# Altium schematic sheet EPS_DCDC_RLCLs.SchDoc: DCDC / RLCLs
size A4; SheetNumber: 36; SheetTotal: 51
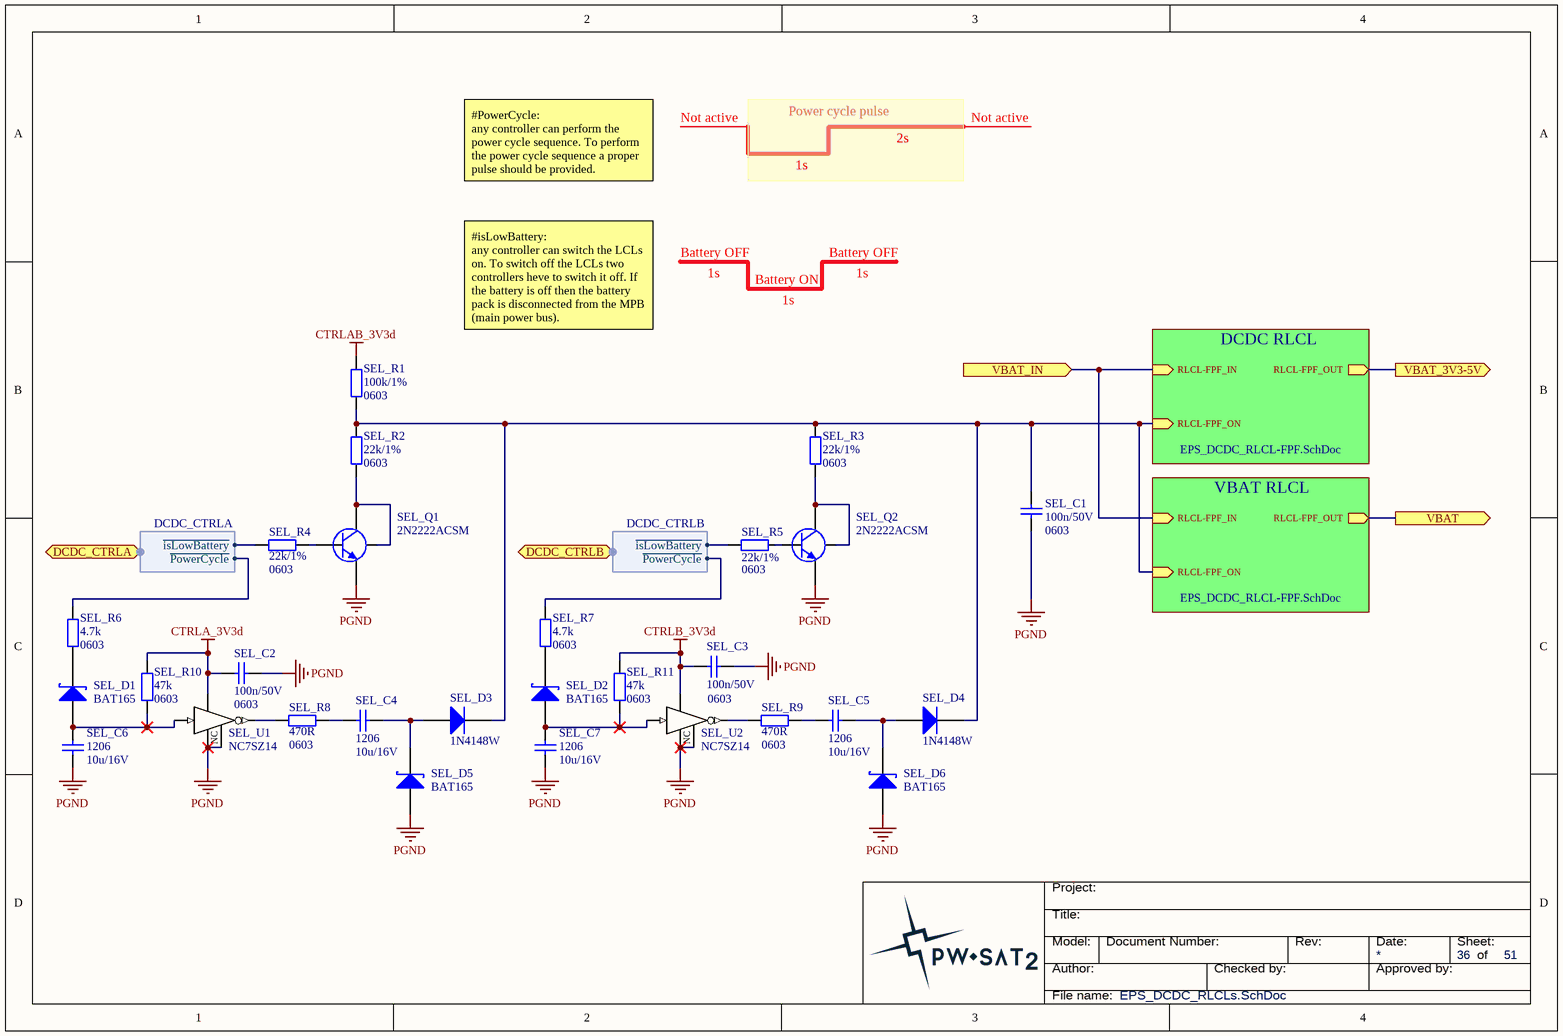
[diagram p0: EPS_DCDC_RLCLs.SchDoc]

## Parts
SEL_C1  value 100n/50V  Package: 0603  [SMD_Capacitor_0603]  (hidden comment: Cap)
SEL_C2  Package: 0603  [SMD_Capacitor_0603]  (hidden comment: 100n/50V)
SEL_C3  Package: 0603  [SMD_Capacitor_0603]  (hidden comment: 100n/50V)
SEL_C4  Packge: 1206  [SMD_Capacitor_1206]  (hidden comment: 10u/16V)
SEL_C5  Packge: 1206  [SMD_Capacitor_1206]  (hidden comment: 10u/16V)
SEL_C6  Packge: 1206  [SMD_Capacitor_1206]  (hidden comment: 10u/16V)
SEL_C7  Packge: 1206  [SMD_Capacitor_1206]  (hidden comment: 10u/16V)
SEL_D1  BAT165  [SOD323]
SEL_D2  BAT165  [SOD323]
SEL_D3  1N4148W  [SOD-123]
SEL_D4  1N4148W  [SOD-123]
SEL_D5  BAT165  [SOD323]
SEL_D6  BAT165  [SOD323]
SEL_Q1  2N2222ACSM  [LCC1-4_BEC]
SEL_Q2  2N2222ACSM  [LCC1-4_BEC]
SEL_R1  Package: 0603  [SMD_Resistor_0603]  (hidden comment: 100k/1%)
SEL_R2  Package: 0603  [SMD_Resistor_0603]  (hidden comment: 22k/1%)
SEL_R3  Package: 0603  [SMD_Resistor_0603]  (hidden comment: 22k/1%)
SEL_R4  Package: 0603  [SMD_Resistor_0603]  (hidden comment: 22k/1%)
SEL_R5  Package: 0603  [SMD_Resistor_0603]  (hidden comment: 22k/1%)
SEL_R6  Package: 0603  [SMD_Resistor_0603]  (hidden comment: 4.7k)
SEL_R7  Package: 0603  [SMD_Resistor_0603]  (hidden comment: 4.7k)
SEL_R8  Package: 0603  [SMD_Resistor_0603]  (hidden comment: 470R)
SEL_R9  Package: 0603  [SMD_Resistor_0603]  (hidden comment: 470R)
SEL_R10  Package: 0603  [SMD_Resistor_0603]  (hidden comment: 47k)
SEL_R11  Package: 0603  [SMD_Resistor_0603]  (hidden comment: 47k)
SEL_U1  NC7SZ14  [SOT23-5]
SEL_U2  NC7SZ14  [SOT23-5]

## Sub-sheets
DCDC RLCL = EPS_DCDC_RLCL-FPF.SchDoc: RLCL-FPF_IN (in), RLCL-FPF_OUT (out), RLCL-FPF_ON (in)
VBAT RLCL = EPS_DCDC_RLCL-FPF.SchDoc: RLCL-FPF_IN (in), RLCL-FPF_OUT (out), RLCL-FPF_ON (in)

## Ports
DCDC_CTRLA (harness DCDC_CTRLA), DCDC_CTRLB (harness DCDC_CTRLB), VBAT (out), VBAT_3V3-5V (out), VBAT_IN (in)

## Harnesses
DCDC_CTRLB: ~{PowerCycle}, ~{isLowBattery}
DCDC_CTRLA: ~{PowerCycle}, ~{isLowBattery}

## Nets
CTRLA_3V3d: SEL_C2.1 SEL_R10.2 SEL_U1.5(Vcc)
CTRLAB_3V3d: SEL_R1.2
CTRLB_3V3d: SEL_C3.1 SEL_R11.2 SEL_U2.5(Vcc)
PGND: SEL_C1.2 SEL_C2.2 SEL_C3.2 SEL_C6.1 SEL_C7.1 SEL_D5.A SEL_D6.A SEL_Q1.E SEL_Q2.E SEL_U1.1(NC) SEL_U1.3(GND) SEL_U2.1(NC) SEL_U2.3(GND)
VBAT: port VBAT, sheet VBAT RLCL/RLCL-FPF_OUT
VBAT_3V3-5V: port VBAT_3V3-5V, sheet DCDC RLCL/RLCL-FPF_OUT
VBAT_IN: port VBAT_IN, sheet DCDC RLCL/RLCL-FPF_IN, sheet VBAT RLCL/RLCL-FPF_IN
NetSEL_C1_1: SEL_C1.1 SEL_D3.K SEL_D4.K SEL_R1.1 SEL_R2.2 SEL_R3.2 ; sheet DCDC RLCL/RLCL-FPF_ON, sheet VBAT RLCL/RLCL-FPF_ON
NetSEL_C4_1: SEL_C4.1 SEL_R8.2
NetSEL_C4_2: SEL_C4.2 SEL_D3.A SEL_D5.K
NetSEL_C5_1: SEL_C5.1 SEL_R9.2
NetSEL_C5_2: SEL_C5.2 SEL_D4.A SEL_D6.K
NetSEL_C6_2: SEL_C6.2 SEL_D1.A SEL_R10.1 SEL_U1.2(A)
NetSEL_C7_2: SEL_C7.2 SEL_D2.A SEL_R11.1 SEL_U2.2(A)
NetSEL_D1_K: SEL_D1.K SEL_R6.1
NetSEL_D2_K: SEL_D2.K SEL_R7.1
NetSEL_Q1_B: SEL_Q1.B SEL_R4.2
NetSEL_Q1_C: SEL_Q1.C SEL_Q1.Shield SEL_R2.1
NetSEL_Q2_B: SEL_Q2.B SEL_R5.2
NetSEL_Q2_C: SEL_Q2.C SEL_Q2.Shield SEL_R3.1
NetSEL_R4_1: SEL_R4.1 ; port DCDC_CTRLA.~{isLowBattery}
NetSEL_R5_1: SEL_R5.1 ; port DCDC_CTRLB.~{isLowBattery}
NetSEL_R6_2: SEL_R6.2 ; port DCDC_CTRLA.~{PowerCycle}
NetSEL_R7_2: SEL_R7.2 ; port DCDC_CTRLB.~{PowerCycle}
NetSEL_R8_1: SEL_R8.1 SEL_U1.4(Y)
NetSEL_R9_1: SEL_R9.1 SEL_U2.4(Y)

## Notes on the sheet
- Power cycle pulse
- #PowerCycle:
  any controller can perform the power cycle sequence. To perform the power cycle sequence a proper pulse should be provided.
- Not active
- 1s
- 2s
- Battery OFF
- Battery ON
- #isLowBattery:
  any controller can switch the LCLs on. To switch off the LCLs two controllers heve to switch it off. If the battery is off then the battery pack is disconnected from the MPB (main power bus).
- Title:
- Project:
- Author:
- Model:
- Document Number:
- Checked by:
- Rev:
- Date:
- Approved by:
- Sheet:
- of
- File name:

## Library data of the parts
SEL_C2 SEL_C3 = Cer_C0603T104K5RALTU: Ceramic Cap Kemet COTS 100n/50V X7R 0603; Manufacturer: Kemet; ManufacturerPartNumber: C0603T104K5RALTU; Value: 100n/50V
SEL_C4-SEL_C7 = Cer_C1206T106K4RACTU: Ceramic Cap Kemet COTS 10u/16V X7R 1206; ManufacturerPartNumber: C1206T106K4RACTU; Manufacturer: Kemet; Value: 10u/16V
SEL_D1 SEL_D2 SEL_D5 SEL_D6 = BAT165: Madium Power AF Schottky 750mA 40V Diode; Manufacturer: Infineon; Value: BAT165
SEL_D3 SEL_D4 = 1N4148W: Small Signal Fast Switching Diode; Manufacturer: Vishay; Value: 1N4148W
SEL_Q1 SEL_Q2 = 2N2222ACSM: Silicon Planar Epitaxial NPN Transistor.; Manufacturer: Semelab-TT; Value: 2N2222ACSM
SEL_R1-SEL_R11 = Res
  SEL_R1: Value: 100k/1%
  SEL_R2-SEL_R5: Value: 22k/1%
  SEL_R6 SEL_R7: Value: 4.7k
  SEL_R8 SEL_R9: Value: 470R
  SEL_R10 SEL_R11: Value: 47k
SEL_U1 SEL_U2 = NC7SZ14: TinyLogic UHS TinyLogic UHS Two-Input NAND Gate.; Manufacturer: Fairchild Semiconductor; Value: NC7SZ14